# EAGLE design clickerno5vreg (EAGLE 9.6.2)
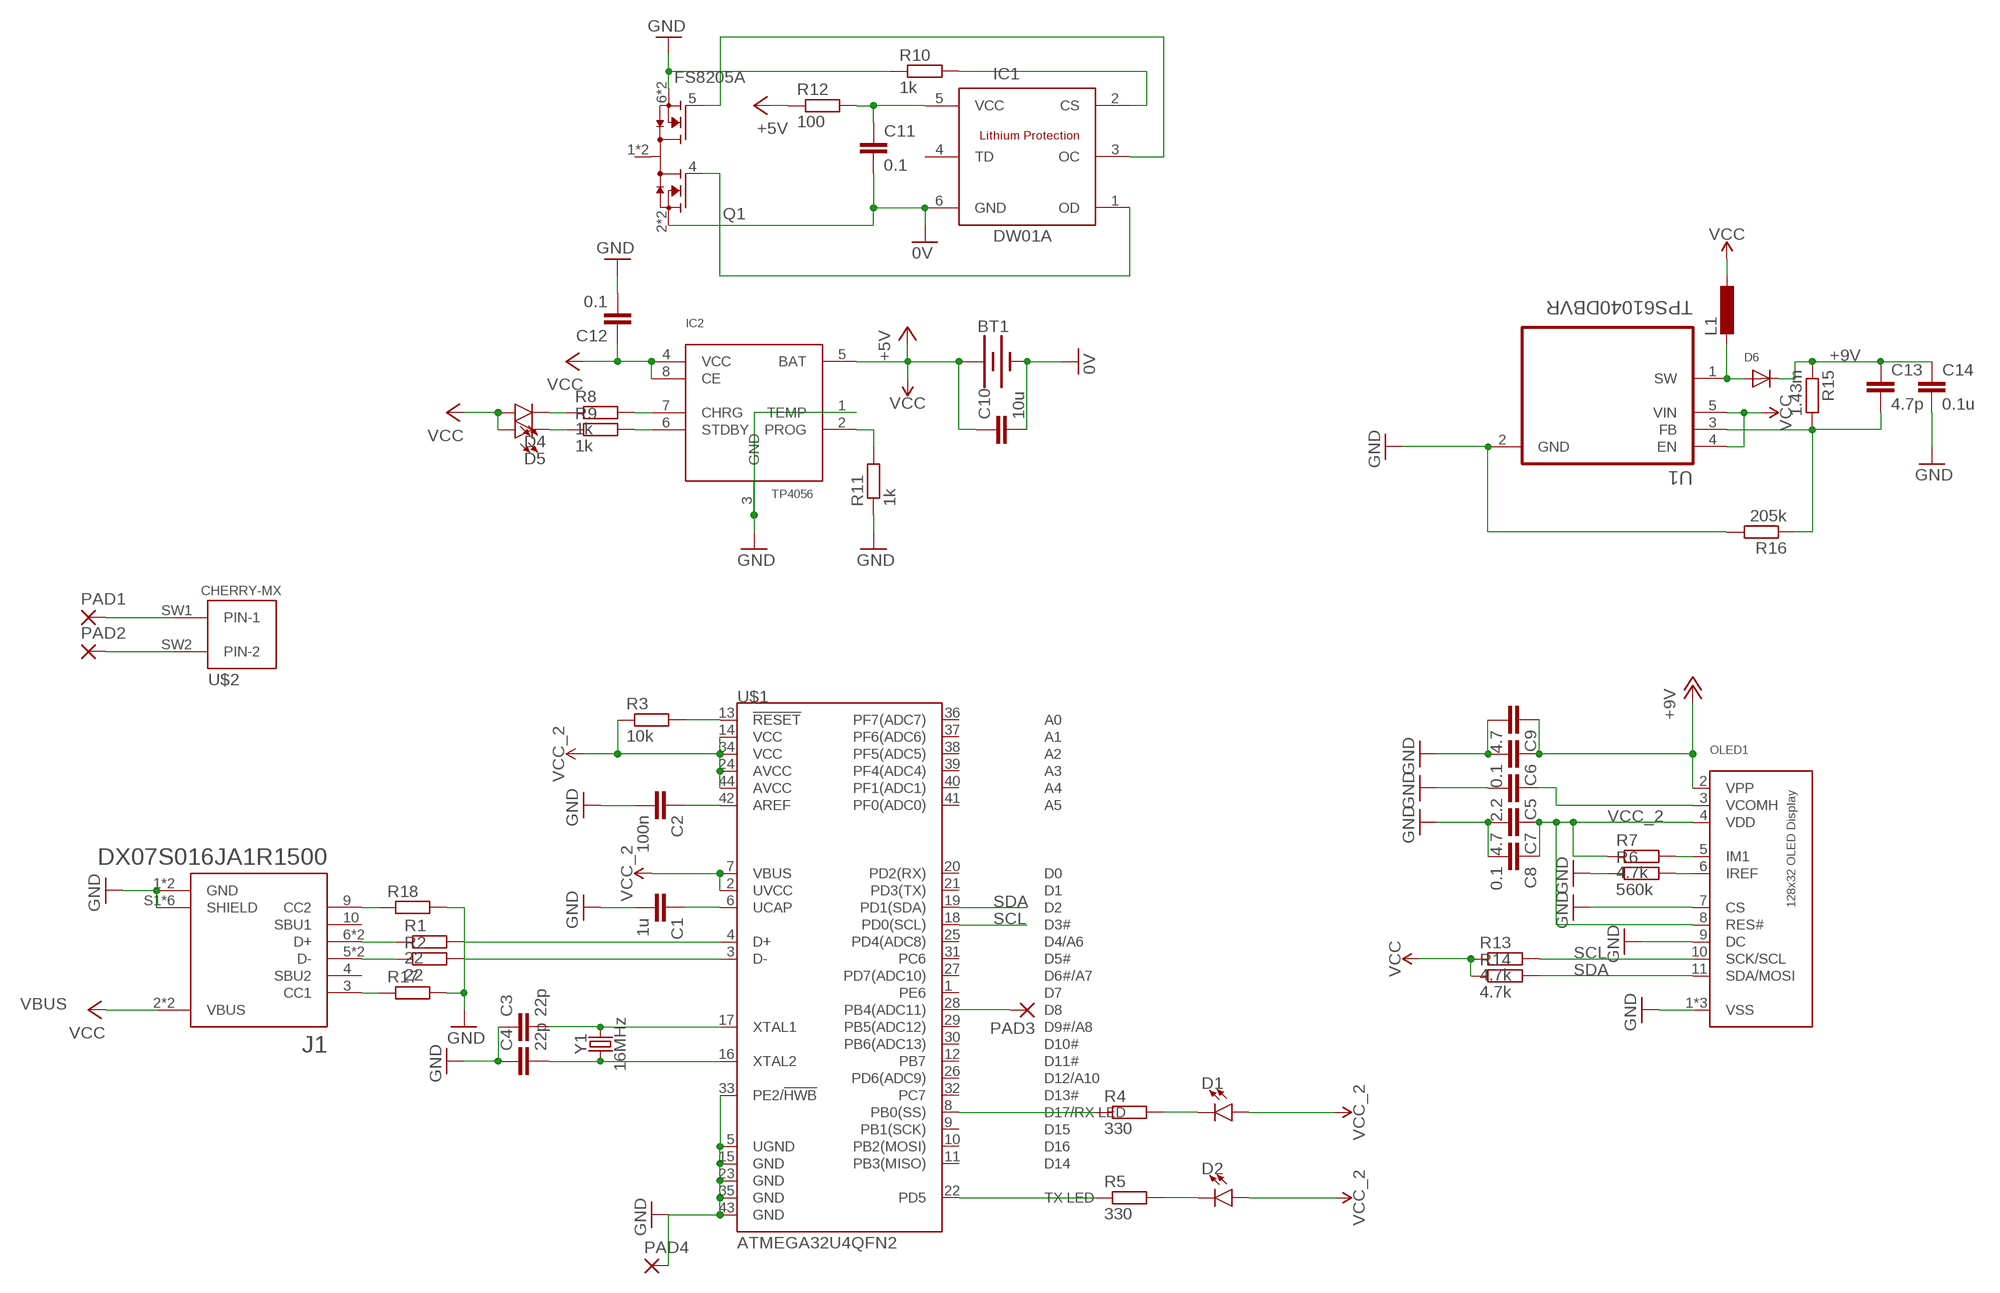
[diagram p0: schematic, sheet 1]

## Parts
BT1  BATTERY-18650  [BATTERY_18650-HOLDER]
C1  1u  C-EUC0603  [C0603]
C2  100n  C-EUC0603  [C0603]
C3  22p  C-EUC0603  [C0603]
C4  22p  C-EUC0603  [C0603]
C5  2.2  C-EUC0603  [C0603]
C6  0.1  C-EUC0603  [C0603]
C7  4.7  C-EUC0603  [C0603]
C8  0.1  C-EUC0603  [C0603]
C9  4.7  C-EUC0603  [C0603]
C10  10u  C-EUC0805  [C0805]
C11  0.1  C-EUC0603  [C0603]
C12  0.1  C-EUC0603  [C0603]
C13  4.7p  C-EUC0603  [C0603]
C14  0.1u  C-EUC0603  [C0603]
D1  LED0603  [LED-0603]
D2  LED0603  [LED-0603]
D4  LED0603  [LED-0603]
D5  LED0603  [LED-0603]
D6  DIODE_SOD-123FL  [SOD-123FL]
IC1  DW01A  [SOT23-6]
IC2  TP4056  [SOP-8]
J1  DX07S016JA1R1500  [JAE_DX07S016JA1R1500]
L1  L-EUL3225M  [L3225M]
OLED1  ADAFRUIT_DISPLAY_OLED_128X64_SH1107  [ADAFRUIT_DISPLAY_QT1107P11A]
PAD1  SMD5  [SMD2,54-5,08]
PAD2  SMD5  [SMD2,54-5,08]
PAD3  SMD5  [SMD2,54-5,08]
PAD4  SMD5  [SMD2,54-5,08]
Q1  FS8205A  [SOP65P640X120-8N]
R1  22  R-EU_R0603  [R0603]
R2  22  R-EU_R0603  [R0603]
R3  10k  R-EU_R0603  [R0603]
R4  330  R-EU_R0603  [R0603]
R5  330  R-EU_R0603  [R0603]
R6  560k  R-EU_R0603  [R0603]
R7  4.7k  R-EU_R0603  [R0603]
R8  1k  R-EU_R0603  [R0603]
R9  1k  R-EU_R0603  [R0603]
R10  1k  R-EU_R0603  [R0603]
R11  1k  R-EU_R0603  [R0603]
R12  100  R-EU_R0603  [R0603]
R13  4.7k  R-EU_R0603  [R0603]
R14  4.7k  R-EU_R0603  [R0603]
R15  1.43m  R-EU_R0603  [R0603]
R16  205k  R-EU_R0603  [R0603]
R17  R-EU_R0603  [R0603]
R18  R-EU_R0603  [R0603]
U1  TPS61040DBVR  [SOT95P280X145-5N]
U$1  ATMEGA32U4QFN2  [SPARKFUN-DIGITALIC_QFN-44-NOPAD]
U$2  CHERRY-MX  [CHERRY-MX]
Y1  16MHz  CRYSTAL-16MHZSMD-5X3.2  [CRYSTAL-SMD-5X3.2-4PAD]

## Nets
0V: BT1.GND@1(-) C10.2 C11.2 IC1.6(GND) Q1.2(2,3) Q1.3(2,3)
+9V: C6.1 C9.1 C13.1 C14.1 D6.C OLED1.2(VPP) R15.1
GND: C1.2 C2.2 C3.1 C4.1 C5.2 C6.2 C7.2 C8.2 C9.2 C12.2 C14.2 IC2.1(TEMP) IC2.3(GND) J1.1(GND) J1.12(GND) J1.S1(SHIELD) J1.S2(SHIELD) J1.S3(SHIELD) J1.S4(SHIELD) J1.S5(SHIELD) J1.S6(SHIELD) OLED1.1(VSS) OLED1.7(CS) OLED1.9(DC) OLED1.12(VSS) OLED1.13(VSS) PAD4.1(P) Q1.6(6,7) Q1.7(6,7) R6.1 R10.1 R11.1 R16.2 R17.2 R18.2 U1.2(GND) U$1.5(UGND) U$1.15(GND) U$1.23(GND) U$1.33(PE2/!HWB) U$1.35(GND) U$1.43(GND)
N$1: C1.1 U$1.6(UCAP)
N$2: C2.1 U$1.42(AREF)
N$3: J1.6(D+) J1.8(D+) R1.1
N$4: J1.5(D-) J1.7(D-) R2.1
N$5: R1.2 U$1.4(D+)
N$6: R2.2 U$1.3(D-)
N$7: C4.2 U$1.16(XTAL2) Y1.1
N$8: C3.2 U$1.17(XTAL1) Y1.3
N$9: IC2.6(STDBY) R9.2
N$10: R3.2 U$1.13(!RESET)
N$11: R5.1 U$1.22(PD5)
N$12: R4.1 U$1.8(PB0(SS))
N$13: D1.C R4.2
N$14: D2.C R5.2
N$15: C5.1 OLED1.3(VCOMH)
N$16: C13.2 R15.2 R16.1 U1.3(FB)
N$17: OLED1.5(IM1) R7.2
N$18: IC1.1(OD) Q1.4
N$19: OLED1.6(IREF) R6.2
N$20: IC2.7(CHRG) R8.2
N$21: IC1.3(OC) Q1.5
N$22: C11.1 IC1.5(VCC) R12.2
N$23: D5.C R9.1
N$24: D4.C R8.1
N$25: IC2.2(PROG) R11.2
N$26: IC1.2(CS) R10.2
N$27: D6.A L1.2 U1.1(SW)
N$28: PAD3.1(P) U$1.28(PB4(ADC11))
N$29: PAD2.1(P) U$2.SW2(PIN-2)
N$30: PAD1.1(P) U$2.SW1(PIN-1)
N$31: J1.3(CC1) R17.1
N$32: J1.9(CC2) R18.1
SCL: OLED1.10(SCK/SCL) R13.2 U$1.18(PD0(SCL))
SDA: OLED1.11(SDA/MOSI) R14.2 U$1.19(PD1(SDA))
VBUS: C12.1 D4.A D5.A IC2.4(VCC) IC2.8(CE) J1.2(VBUS) J1.11(VBUS) ; supply symbol labelled VCC
VCC_2: BT1.PWR@1(+) C7.1 C8.1 C10.1 D1.A D2.A IC2.5(BAT) L1.1 OLED1.4(VDD) OLED1.8(RES#) R3.1 R7.1 R12.1 R13.1 R14.1 U1.4(EN) U1.5(VIN) U$1.2(UVCC) U$1.7(VBUS) U$1.14(VCC) U$1.24(AVCC) U$1.34(VCC) U$1.44(AVCC) ; supply symbol labelled VCC, +5V
Unconnected: IC1.4(TD) J1.4(SBU2) J1.10(SBU1) Q1.1(1,8) Q1.8(1,8) U$1.1(PE6) U$1.9(PB1(SCK)) U$1.10(PB2(MOSI)) U$1.11(PB3(MISO)) U$1.12(PB7) U$1.20(PD2(RX)) U$1.21(PD3(TX)) U$1.25(PD4(ADC8)) U$1.26(PD6(ADC9)) U$1.27(PD7(ADC10)) U$1.29(PB5(ADC12)) U$1.30(PB6(ADC13)) U$1.31(PC6) U$1.32(PC7) U$1.36(PF7(ADC7)) U$1.37(PF6(ADC6)) U$1.38(PF5(ADC5)) U$1.39(PF4(ADC4)) U$1.40(PF1(ADC1)) U$1.41(PF0(ADC0))

## Library data of the parts
BT1 = SparkFun-Batteries:BATTERY: Battery - Single Cell A variety of battery chemistries, sizes, and footprints. Device List: 20MM_PTH - Coin Cell Battery Holder - 20mm (PTH) <https://www.sparkfun.com/products/783> 6.8MM_PTH - Coin Cell Battery Holder - 6.8MM(SMD) <https://www.digikey.com/product-detail/en/seiko-instruments/MS621FE-FL11E/728-1057-ND/1889208?WT.srch=1&gclid=CNOQ5a6LzdQCFZS2wAodXCkE0g> 12MM_SMD - Coin Cell Battery Holder - 12mm (SMD) <https://www.sparkfun.com/products/10592> 12MM_PTH - Coin Cell Battery Holder - 12mm (PTH) <https://www.sparkfun.com/products/7948> 20MM_SMD - 20mm Coin Cell Battery Holder (SMD) (2 legs) Used on the Big Time Watch Kit <https://www.sparkfun.com/products/11734> 20MM_SMD_4LEGS - Coin Cell Battery Holder - 20mm (SMD) <https://www.sparkfun.com/products/11892> 20MM_SMD_4LEGS_OVERPASTE - Coin Cell Battery Holder - 20mm (SMD) <https://www.sparkfun.com/products/11892> (Over-paste on the legs) 24.5MM_PTH - Coin Cell Battery Holder - 24.5mm (PTH) <https://www.sparkfun.com/products/8863> 9V - 9V Battery Holder - PC Mount Used on the SparkFun SparkPunk Sound Kit <https://www.sparkfun.com/products/11177> and SparkFun SparkPunk Sequencer Kit <https://www.sparkfun.com/products/12707> 18650 - Battery Holder - 18650 (PTH) <https://www.sparkfun.com/products/13113> AA - Battery Holder - 1xAA (PTH) <https://www.sparkfun.com/products/7949> AAA - Battery Holder - 1xAAA (PTH) <https://www.sparkfun.com/products/12718> AA_KIT - Battery Holder - 1xAA (PTH) <https://www.sparkfun.com/products/7949> Special kit package - pads only have exposed copper on one side of the board. AAA_KIT - Battery Holder - 1xAAA (PTH) <https://www.sparkfun.com/products/12718> Special kit package - pads only have exposed copper on one side of the board.; PROD_ID: BATT-12327; SF_SKU: PRT-13113
C1-C14 = rcl:C-EU: CAPACITOR, European symbol; SPICEPREFIX: C
D1 D2 D4 D5 = SparkFun-LED:LED: LED (Generic) Standard schematic elements and footprints for 5mm, 3mm, 1206, and 0603 sized LEDs. Generic LEDs with no color specified.
D6 = adafruit:DIODE: Diode SMADIODE - SMA Surface Mount Package 20V 1A Schottky Diode Digikey: 641-1014-6-ND DO-1N4148 - Through Hole Small Current Diode SOD-123 20V 1 A (.5mV Vf) Schottky Diode - Digikey: MBRX120TPMSCT-ND SOD-323 10V 570mA (.38mV Vf, 3ns) Schottky Diode - Digikey: ZLLS410CT-ND SOD-523 30V 30mA Schottky Diode (RB751S-40TE61) - Digikey: RB751S-40TE61CT-ND SOT23-R/W - SOT23 Package (R = Solder Paste/Reflow Ovens, W = Hand-Soldering) BAT54Film 40V 300mA - Digikey: 497-7162-1-ND
IC1 = DW01A:DW01A; AVAILABILITY: Unavailable; DESCRIPTION: One Cell Lithium-ion/Polymer Battery Protection IC; MF: Fortune Semiconductor; MP: DW01A; PACKAGE: SOT-23-6 Fortune Semiconductor; PRICE: None
IC2 = TP4056:TP4056; AVAILABILITY: Unavailable; DESCRIPTION: Complete single cell Li-Ion battery with a constant current / constant voltage linear charger; MF: NanJing Top Power ASIC Corp.; MP: TP4056; PACKAGE: Package; PRICE: None
J1 = USBC:DX07S016JA1R1500: USB-C (USB TYPE-C) USB 2.0 Receptacle Connector 24 (16+8 Dummy) Position Surface Mount, Right Angle; Through Hole Check prices <https://pricing.snapeda.com/parts/DX07S016JA1R1500/JAE%20Electronics/view-part?ref=eda>; AVAILABILITY: Warning; DESCRIPTION: USB-C (USB TYPE-C) USB 2.0 Receptacle Connector 24 (16+8 Dummy) Position Surface Mount, Right Angle; Through Hole; MF: JAE Electronics; MP: DX07S016JA1R1500; PACKAGE: None; PRICE: None; PURCHASE-URL: https://pricing.snapeda.com/search/part/DX07S016JA1R1500/?ref=eda
L1 = rcl:L-EU: INDUCTOR, European symbol; SPICEPREFIX: L
OLED1 = clicker:ADAFRUIT_DISPLAY_OLED_128X64_SH1107
PAD1-PAD4 = wirepad:SMD5: SMD PAD
Q1 = FS8205A:FS8205A: N/A; AVAILABILITY: Unavailable; MF: Fortune Semiconductor; MP: FS8205A; PACKAGE: Package; PRICE: None
R1-R18 = rcl:R-EU_: RESISTOR, European symbol; SPICEPREFIX: R
U1 = TPS61040DBVR:TPS61040DBVR: Check prices <https://pricing.snapeda.com/parts/TPS61040DBVR/Texas%20Instruments/view-part?ref=eda>; AVAILABILITY: Good; DESCRIPTION: 28-V, 400-mA Switch Boost Converter in SOT-23 for LCD and White LED Applications 5-SOT-23 -40 to 85; MF: Texas Instruments; MP: TPS61040DBVR; PACKAGE: SOT-23-5 Texas Instruments; PRICE: None; PURCHASE-URL: https://pricing.snapeda.com/search/part/TPS61040DBVR/?ref=eda
U$1 = SparkFun-Retired:ATMEGA32U4: Atmel 44-pin 8-bit Microcontroller with 32KBytes of ISP Flash and USB Controller ----- Please use the QFN-44-NOPAD_1:1 package for the footprint of all boards using a 32U4. Route traces directly away from the pads as much as possible.
U$2 = cherrymx:CHERRY-MX: Cherry MX series keyswitch
Y1 = SparkFun-Clocks:CRYSTAL-16MHZ: 16MHz Crystal Digikey Example <http://www.digikey.com/product-search/en?keywords=535-9122-1-ND> Frequency: 16MHz Frequency Stability: ±50ppm Frequency Tolerance: ±20ppm Load Capacitance: 18pF SparkFun Products: Pro Micro -5V/16MHz <https://www.sparkfun.com/products/12640> SparkFun Serial Enabled LCD Kit <https://www.sparkfun.com/products/10097>; PROD_ID: XTAL-08218; SF_ID: COM-00094

## Board
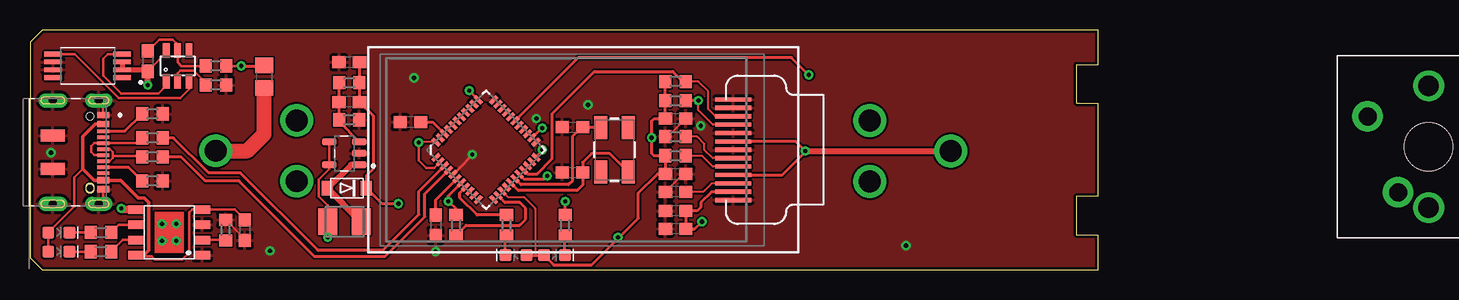
[diagram p1: board, top side]
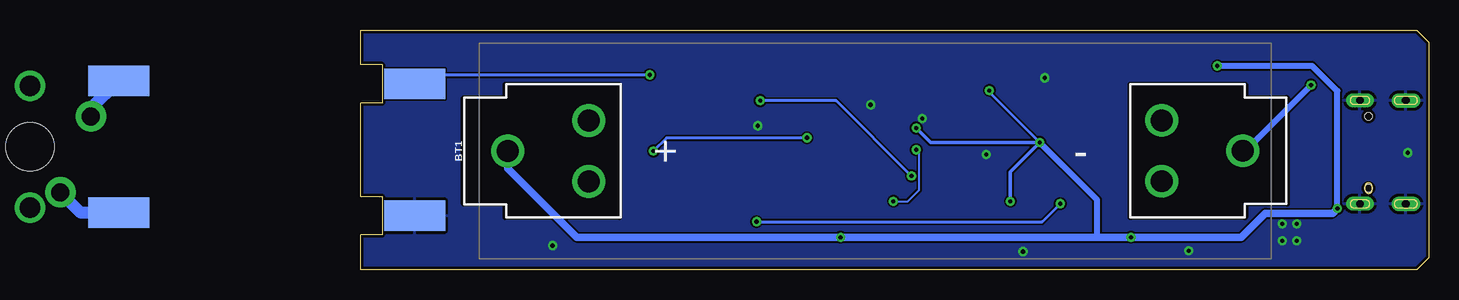
[diagram p2: board, bottom side, seen from below]

Size 89 x 20 mm. Coordinates in mm from the lower left corner, seen from the top.
Outline: 0,19 0,1 1,0 89,0 89,2.9 87.2,2.9 87.2,6.1 89,6.1 89,13.9 87.2,13.9 87.2,17.1 89,17.1 89,20 1,20 0,19
Copper layers (1*16): Top 0.035mm / dielectric 0.15mm / Bottom 0.035mm
Design rules "default *": minimum track width 6mil, minimum drill 0.35mm, track to track 6mil, track to pad 6mil, pad to pad 6mil, via to via 6mil, smd to smd 6mil, copper to edge 10mil, drill to drill 6mil, minimum pad ring 10mil, minimum via ring 8mil, stop-mask expansion 4mil, vias tented up to drill 20mil, thermal gap 10mil

### Footprints (pad centres in the part's own frame; a part is rotated, then mirrored left to right if it is on the bottom)
BATTERY_18650-HOLDER = drill 1.829: GND@1 30.628,0.01; GND@2 23.88,2.55; GND@3 23.88,-2.53; PWR@1 -30.628,-0.01; PWR@2 -23.88,2.53; PWR@3 -23.88,-2.55
C0603 = smd 1.1 x 1: 1 -0.85,0; 2 0.85,0
C0805 = smd 1.3 x 1.5: 1 -0.95,0; 2 0.95,0
LED-0603 = smd 1 x 1: A -0.877,0; C 0.877,0
SOD-123FL = smd 0.91 x 1.22: A 1.637,0; C -1.637,0
SOT23-6 = smd 0.55 x 1.2: 1 -0.95,-1.3; 2 0,-1.3; 3 0.95,-1.3; 4 0.95,1.3; 5 0,1.3; 6 -0.95,1.3
SOP-8 = smd 1.3 x 0.7: 1 -2.75,1.905; 2 -2.75,0.635; 3 -2.75,-0.635; 4 -2.75,-1.905; 5 2.75,-1.905; 6 2.75,-0.635; 7 2.75,0.635; 8 2.75,1.905
JAE_DX07S016JA1R1500 = smd 0.52 x 1: 1 -3.1,1.1; 2 -2.35,1.1; 11 2.35,1.1; 12 3.1,1.1 | smd 0.27 x 1: 3 -1.75,1.1; 4 -1.25,1.1; 5 -0.75,1.1; 6 -0.25,1.1; 7 0.25,1.1; 8 0.75,1.1; 9 1.25,1.1; 10 1.75,1.1 | smd 1 x 2: S1 -1.4,-3.1; S2 1.4,-3.1 | drill 0.65 long: S3 -4.32,0.725; S4 4.32,0.725 | drill 0.65 pad 1.2 long: S5 -4.32,-3.1; S6 4.32,-3.1 | hole 0.6: 3,0 | hole 0.63: 3,0; -3,0
L3225M = smd 1.6 x 2.2: 1 -1.4,0; 2 1.4,0
ADAFRUIT_DISPLAY_QT1107P11A = smd 3 x 0.35: 1 -5.38,-4.2; 2 -5.38,-3.5; 3 -5.38,-2.8; 4 -5.38,-2.1; 5 -5.38,-1.4; 6 -5.38,-0.7; 7 -5.38,0; 8 -5.38,0.7; 9 -5.38,1.4; 10 -5.38,2.1; 11 -5.38,2.8; 12 -5.38,3.5; 13 -5.38,4.2
SMD2,54-5,08 = smd 2.54 x 5.08: 1 0,0
SOP65P640X120-8N = smd 1.56 x 0.4: 1 -2.88,0.975; 2 -2.88,0.325; 3 -2.88,-0.325; 4 -2.88,-0.975; 5 2.88,-0.975; 6 2.88,-0.325; 7 2.88,0.325; 8 2.88,0.975
R0603 = smd 1 x 1.1: 1 -0.85,0; 2 0.85,0
SOT95P280X145-5N = smd 1.21 x 0.59: 1 -1.255,0.95; 2 -1.255,0; 3 -1.255,-0.95; 4 1.255,-0.95; 5 1.255,0.95
SPARKFUN-DIGITALIC_QFN-44-NOPAD = smd 0.8 x 0.3: 1 -3.4,2.5; 2 -3.4,2; 3 -3.4,1.5; 4 -3.4,1; 5 -3.4,0.5; 6 -3.4,0; 7 -3.4,-0.5; 8 -3.4,-1; 9 -3.4,-1.5; 10 -3.4,-2; 11 -3.4,-2.5; 23 3.4,-2.5; 24 3.4,-2; 25 3.4,-1.5; 26 3.4,-1; 27 3.4,-0.5; 28 3.4,0; 29 3.4,0.5; 30 3.4,1; 31 3.4,1.5; 32 3.4,2; 33 3.4,2.5 | smd 0.3 x 0.8: 12 -2.5,-3.4; 13 -2,-3.4; 14 -1.5,-3.4; 15 -1,-3.4; 16 -0.5,-3.4; 17 0,-3.4; 18 0.5,-3.4; 19 1,-3.4; 20 1.5,-3.4; 21 2,-3.4; 22 2.5,-3.4; 34 2.5,3.4; 35 2,3.4; 36 1.5,3.4; 37 1,3.4; 38 0.5,3.4; 39 0,3.4; 40 -0.5,3.4; 41 -1,3.4; 42 -1.5,3.4; 43 -2,3.4; 44 -2.5,3.4
CHERRY-MX = drill 1.714 pad 1.93: P$3 -5.08,0; P$4 5.08,0 | drill 1.5 pad 2.54: SW1 -3.81,2.54; SW2 2.54,5.08 | hole 4: 0,0
CRYSTAL-SMD-5X3.2-4PAD = smd 1.9 x 1.1: 1 -1.85,-1.15; 2 1.85,-1.15; 3 1.85,1.15; 4 -1.85,1.15

### Placement (x,y rotation side)
BT1  46.1,9.91 0 bottom
C1  33.8,3.7 270 top
C2  31.7,12.3 180 top
C3  45.2,11.9 0 top
C4  45.2,8.1 0 top
C5  53.8,6.5 180 top
C6  53.8,4.9 180 top
C7  53.8,12.6 0 top
C8  53.8,8 0 top
C9  53.8,3.4 180 top
C10  19.5,16.1 270 top
C11  9.8,17.4 270 top
C12  17.9,3.3 270 top
C13  26.6,14 180 top
C14  26.6,17.3 180 top
D1  40.5,1.2 180 top
D2  43.7,1.2 0 top
D4  2.4,1.5 0 top
D5  2.4,3.1 0 top
D6  26.4,6.8 180 top
IC1  12.3,17 0 top
IC2  11.6,3.1 180 top
J1  5,9.8 270 top
L1  26.2,4 0 top
OLED1  64,10 0 top
PAD1  109.15,4.75 90 bottom  (outside the outline)
PAD2  109.15,15.75 90 bottom  (outside the outline)
PAD3  84.5,15.5 90 bottom
PAD4  84.5,4.5 90 bottom
Q1  4.8,17 180 top
R1  10.2,9.4 0 top
R2  10.2,11 0 top
R3  35.5,3.7 270 top
R4  39.7,3.7 270 top
R5  44.6,3.7 270 top
R6  53.8,11.1 0 top
R7  53.8,9.5 0 top
R8  5.9,1.5 0 top
R9  5.9,3.1 0 top
R10  15.5,15.4 180 top
R11  16.3,3.3 270 top
R12  15.5,17 180 top
R13  53.8,14.1 0 top
R14  53.8,15.7 0 top
R15  26.6,15.6 180 top
R16  26.6,12.5 0 top
R17  10.2,13 0 top
R18  10.2,7.4 0 top
U1  26.2,9.7 180 top
U$1  38,10 45 top
U$2  116.55,10.25 90 top  (outside the outline)
Y1  48.7,10 90 top

### Tracks (layer width: path | path; a pad name or v marks a point on that pad's centre or on a via)
0V  (via drill 0.35)
  Top 0.2: IC1.6 11.35,18.1 C11.2
  Top 0.406: Q1.3 Q1.2 9.68,16.68 C11.2
  Top 0.508: v9.8,15.4 C11.2
  Top 1.27: BT1.GND@1 18.12,9.92 19.5,11.3 C10.2
  Bottom 0.508: v9.8,15.4 15.28,9.92 BT1.GND@1
+9V  (via drill 0.35)
  Top 0.254: OLED1.2 56.8,6.5 55.9,5.6 55.9,5.2 55.6,4.9 C6.1 C9.1 55.4,3.4 v56,4 | v30.7,5.5 29.34,5.5 D6.C 28.04,7.84 28.6,8.4 28.6,12.85 C13.1 R15.1 C14.1
  Bottom 0.254: v56,4 32.2,4 v30.7,5.5
GND  (via drill 0.35)
  Top 0.152: J1.1 6.1,13.74 J1.S3
  Top 0.2: J1.12 6.1,5.86 J1.S4 | C5.2 54.45,8 C8.2 | C7.2 53.15,11.1 R6.1 | R11.1 17.9,2.55 C12.2
  Top 0.254: U$1.5 35.79,8.5 35.8,8.5 36.86,9.56 v36.86,9.62
  other vias: 11,3.8 55.9,12 42.2,12.6 20,1.55 73,2 32,16 1.75,9.75 46.5,13.75 11,2.4 12.2,3.8 33.8,1.5 12.2,2.4
  pour Top (isolate 0.1): 0,0 89,0 89,20 0,20
  pour Bottom (isolate 0.1): 0,0 89,0 89,20 0,20
N$1
  Top 0.254: C1.1 33.8,5.8 U$1.6
N$2
  Top 0.254: C2.1 33.58,12.3 U$1.42
N$3
  Top 0.2: J1.6 6.65,10.05 6.9,9.8 6.9,9.5 | J1.8 6.65,9.05 6.9,9.3 6.9,9.5 | 6.9,9.5 9.25,9.5 R1.1
N$4
  Top 0.2: J1.7 5.35,9.55 5.1,9.8 5.1,10.3 5.35,10.55 J1.5 8.9,10.55 R2.1
N$5
  Top 0.254: U$1.4 32.9,6.31 32.9,4.4 29.6,1.1 23.7,1.1 17.4,7.4 14.6,7.4 12.6,9.4 R1.2
N$6
  Top 0.254: U$1.3 32.4,6.52 32.4,4.6 29.4,1.6 24,1.6 17.54,8.06 14.89,8.06 11.95,11 R2.2
N$7
  Top 0.254: Y1.1 48.3,9.7 46.8,9.7 46.05,8.95 C4.2 46.05,7.05 45.6,6.6 40.69,6.6 U$1.16
N$8
  Top 0.254: Y1.3 47.5,11.9 C3.2 45.95,11.9 45.19,11.1 45.19,7.4 44.86,7.1 40.9,7.1 U$1.17
N$9
  Top 0.2: R9.2 7.38,3.73 IC2.6
N$10
  Top 0.254: R3.2 36.35,3.7 40.8,3.7 41.3,4.2 41.3,5.1 40.8,5.6 39.57,5.6 U$1.13
N$11  (via drill 0.35)
  Top 0.152: v42.7,10 42.17,9.47 U$1.22
  Top 0.254: R5.1 v44.6,5.7
  Bottom 0.152: v42.7,10 42.45,9.75 42.45,6.65 43.4,5.7 v44.6,5.7
N$12
  Top 0.254: R4.1 37.25,4.55 35.81,5.99 35.81,6.39 U$1.8
N$13
  Top 0.254: D1.C 39.62,2.77 R4.2
N$14
  Top 0.254: D2.C 44.58,2.83 R5.2
N$15
  Top 0.152: OLED1.3 56.8,7.2 56.1,6.5 C5.1
N$16
  Top 0.254: R15.2 C13.2 R16.1 25.75,12.36 U1.3
N$17
  Top 0.152: OLED1.5 56.9,8.6 56,9.5 R7.2
N$18
  Top 0.2: IC1.1 11.35,15.35 10.7,14.7 7.6,14.7 6.1,16.2 6.1,17.6 6.47,17.98 Q1.4
N$19
  Top 0.152: OLED1.6 56.9,9.3 56.2,10 56.2,10.5 55.6,11.1 R6.2
N$20
  Top 0.2: R8.2 7.71,2.46 IC2.7
N$21
  Top 0.2: IC1.3 13.25,15.05 12.5,14.3 7.4,14.3 3.73,17.98 Q1.5
N$22
  Top 0.2: C11.1 10.75,19.2 11.9,19.2 12.3,18.8 IC1.5 12.3,17.3 12.6,17 R12.2
N$23
  Top 0.2: D5.C R9.1
N$24
  Top 0.2: D4.C R8.1
N$25
  Top 0.2: IC2.2 16.29,2.46 R11.2
N$26
  Top 0.2: IC1.2 12.3,16.4 12.5,16.6 13.64,16.6 14.65,15.59 R10.2
N$27
  Top 0.508: U1.1 26.75,8.75 24.8,6.8 D6.A 27.56,4 L1.2
N$28  (via drill 0.35)
  Top 0.254: v64.9,16.25 63.45,17.7 45.7,17.7 U$1.28
  Bottom 0.254: PAD3.1 83.75,16.25 v64.9,16.25
N$29
  Bottom 1.016: PAD2.1 111.47,13.43 U$2.SW2
N$30
  Bottom 1.016: PAD1.1 112.32,4.75 U$2.SW1
N$31
  Top 0.254: J1.3 7.9,11.55 R17.1
N$32
  Top 0.254: J1.9 8.2,8.55 R18.1
SCL  (via drill 0.35)
  Top 0.152: OLED1.10 56.9,12.1 55.7,13.3 v55.7,14.1 | 54.7,14.1 R13.2
  Top 0.254: v55.7,14.1 54.7,14.1 | U$1.18 41.16,7.55 42.83,7.55 v43.09,7.82
  Bottom 0.254: v43.09,7.82 49.38,14.1 v55.7,14.1
SDA
  Top 0.152: OLED1.11 57.1,12.8 56.5,13.4 56.5,14.9 55.7,15.7 R14.2
  Top 0.254: U$1.19 41.43,7.99 42.26,7.99 43.52,9.25 43.52,13.02 47.03,16.53 53.57,16.53 54.4,15.7 R14.2 | U$1.19
VBUS
  Top 0.2: C12.1 17.05,5 IC2.4 13.51,5 13.25,4.75 13.25,1.4 12.71,0.85 10.39,0.85 10.15,1.09 8.95,1.09 IC2.8 | D4.A D5.A 3.7,5.28 3.7,7.7 4.4,8.4
  Top 0.305: J1.2 5.45,12.15 4.4,11.1 4.4,8.4 5.35,7.45 J1.11 7.55,7.45 9,6 9.5,6 9.9,5.6 9.9,1.6 9.49,1.2 IC2.8
VCC_2  (via drill 0.35)
  Top 0.152: U$1.14 39.83,6.05 41.15,6.05 42.1,5.1 42.1,1.2 | U$1.44 32.44,10.64 v32.4,10.6
  Top 0.2: R12.1 v17.6,17 | L1.1 24.8,5.34 24.05,6.08 24.05,7.51 24.95,8.4 U1.5 U1.4 | U$1.2 33.67,8.5 33,8.5 32.4,9.1 v32.4,10.6
  Top 0.254: OLED1.4 62.7,7.9 64.7,9.9 | OLED1.8 63.8,10.7 v64.6,9.9 | R14.1 R13.1 C7.1 52,12.6 51.8,12.4 v51.8,11 51.8,9.7 52,9.5 R7.1 C8.1 52.3,8 50.7,6.4 50.7,4.28 46.8,0.38 43.64,0.38 D2.A 42.1,1.2 D1.A | L1.1 v24.8,2.7 | v17.6,17 20,17 19.95,17.05 C10.1 | U$1.7 34.85,6.14 v34.85,5.7 35.5,5.05 R3.1 | U$1.24 42.64,11.81 v42.69,11.81 | U$1.34 36.6,14.94 v36.6,14.95
  Top 0.508: v64.6,9.9 64.7,9.9 BT1.PWR@1
  Top 0.61: v7.6,5.1 7.7,5 IC2.5
  Bottom 0.254: v51.8,11 63.5,11 v64.6,9.9 | v36.6,14.95 36.6,14.8 v32.4,10.6
  Bottom 0.305: v42.69,11.81 41.48,10.6 v32.4,10.6 34.85,8.15 v34.85,5.7
  Bottom 0.508: v7.6,5.1 7.6,14.9 9.7,17 v17.6,17 | v32.4,10.6 27.65,5.85 27.65,2.7
  Bottom 0.61: v7.6,5.1 8,4.7 13.6,4.7 15.6,2.7 v24.8,2.7 27.65,2.7 v49,2.7 71,2.7 76.73,8.43 BT1.PWR@1